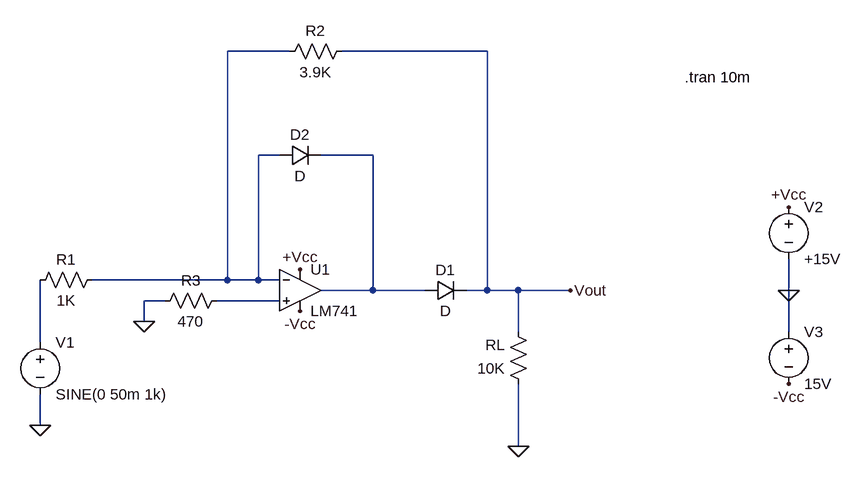
[diagram p0: schematic half Wave Rectifier.asc]
half Wave Rectifier.asc, the LTspice schematic file:
Version 4
SHEET 1 1012 680
WIRE 160 -208 64 -208
WIRE 464 -208 240 -208
WIRE 144 -48 112 -48
WIRE 288 -48 208 -48
WIRE 64 144 64 -208
WIRE 64 144 -144 144
WIRE 112 144 112 -48
WIRE 112 144 64 144
WIRE 144 144 112 144
WIRE 288 160 288 -48
WIRE 288 160 208 160
WIRE 368 160 288 160
WIRE 464 160 464 -208
WIRE 464 160 432 160
WIRE 512 160 464 160
WIRE 592 160 512 160
WIRE 928 160 928 112
WIRE -32 176 -64 176
WIRE 144 176 48 176
WIRE -64 208 -64 176
WIRE 512 224 512 160
WIRE 928 224 928 160
WIRE -224 240 -224 144
WIRE -224 368 -224 320
WIRE 512 400 512 304
FLAG -224 368 0
FLAG -64 208 0
FLAG 512 400 0
FLAG 928 160 0
FLAG 592 160 Vout
FLAG 176 128 +Vcc
FLAG 928 32 +Vcc
FLAG 176 192 -Vcc
FLAG 928 304 -Vcc
SYMBOL Opamps\\LM741 176 96 R0
SYMATTR InstName U1
SYMBOL diode 368 144 M90
WINDOW 0 0 32 VBottom 2
WINDOW 3 32 32 VTop 2
SYMATTR InstName D1
SYMBOL diode 144 -64 M90
WINDOW 0 0 32 VBottom 2
WINDOW 3 32 32 VTop 2
SYMATTR InstName D2
SYMBOL res -128 128 R90
WINDOW 0 0 56 VBottom 2
WINDOW 3 32 56 VTop 2
SYMATTR InstName R1
SYMATTR Value 1K
SYMBOL res 256 -224 R90
WINDOW 0 0 56 VBottom 2
WINDOW 3 32 56 VTop 2
SYMATTR InstName R2
SYMATTR Value 3.9K
SYMBOL res 64 160 R90
WINDOW 0 0 56 VBottom 2
WINDOW 3 32 56 VTop 2
SYMATTR InstName R3
SYMATTR Value 470
SYMBOL res 528 320 R180
WINDOW 0 36 76 Left 2
WINDOW 3 36 40 Left 2
SYMATTR InstName RL
SYMATTR Value 10K
SYMBOL voltage -224 224 R0
SYMATTR InstName V1
SYMATTR Value SINE(0 50m 1k)
SYMBOL voltage 928 16 R0
SYMATTR InstName V2
SYMATTR Value +15V
SYMBOL voltage 928 208 R0
SYMATTR InstName V3
SYMATTR Value 15V
TEXT 768 -168 Left 2 !.tran 10m

The netlist it stands for:
* half Wave Rectifier.asc
XU1 N003 N001 +Vcc -Vcc N002 LM741  ; pins In+ In- V+ V- OUT
D1 N002 Vout D
D2 N001 N002 D
R1 N001 N004 1K
R2 Vout N001 3.9K
R3 N003 0 470
RL 0 Vout 10K
V1 N004 0 SINE(0 50m 1k)
V2 +Vcc 0 +15V
V3 0 -Vcc 15V
.model D D
.lib standard.dio
.tran 10m
.lib LM741.lib
.backanno
.end